# Altium schematic sheet DDR3_Memory.SchDoc: RNG RPI Interface
size 420 x 297 mm; Author: G.Kasprowicz; CompanyName: WUT ISE; DrawnBy: G.Kasprowicz; Organization: WUT ISE; Address1: PW ISE; Address2: Nowowiejska 15/19 00-665 Warsaw; Address3: gkasprow@gmail.com; Revision: 2; SheetNumber: -; SheetTotal: -; ModifiedBy: -; CheckedDate: -; Title2: DDR3 memory; DivGrp: WUT ISE; Designer: G.Kasprowicz; ModifiedDate: -; ProjectName: Sensor Box
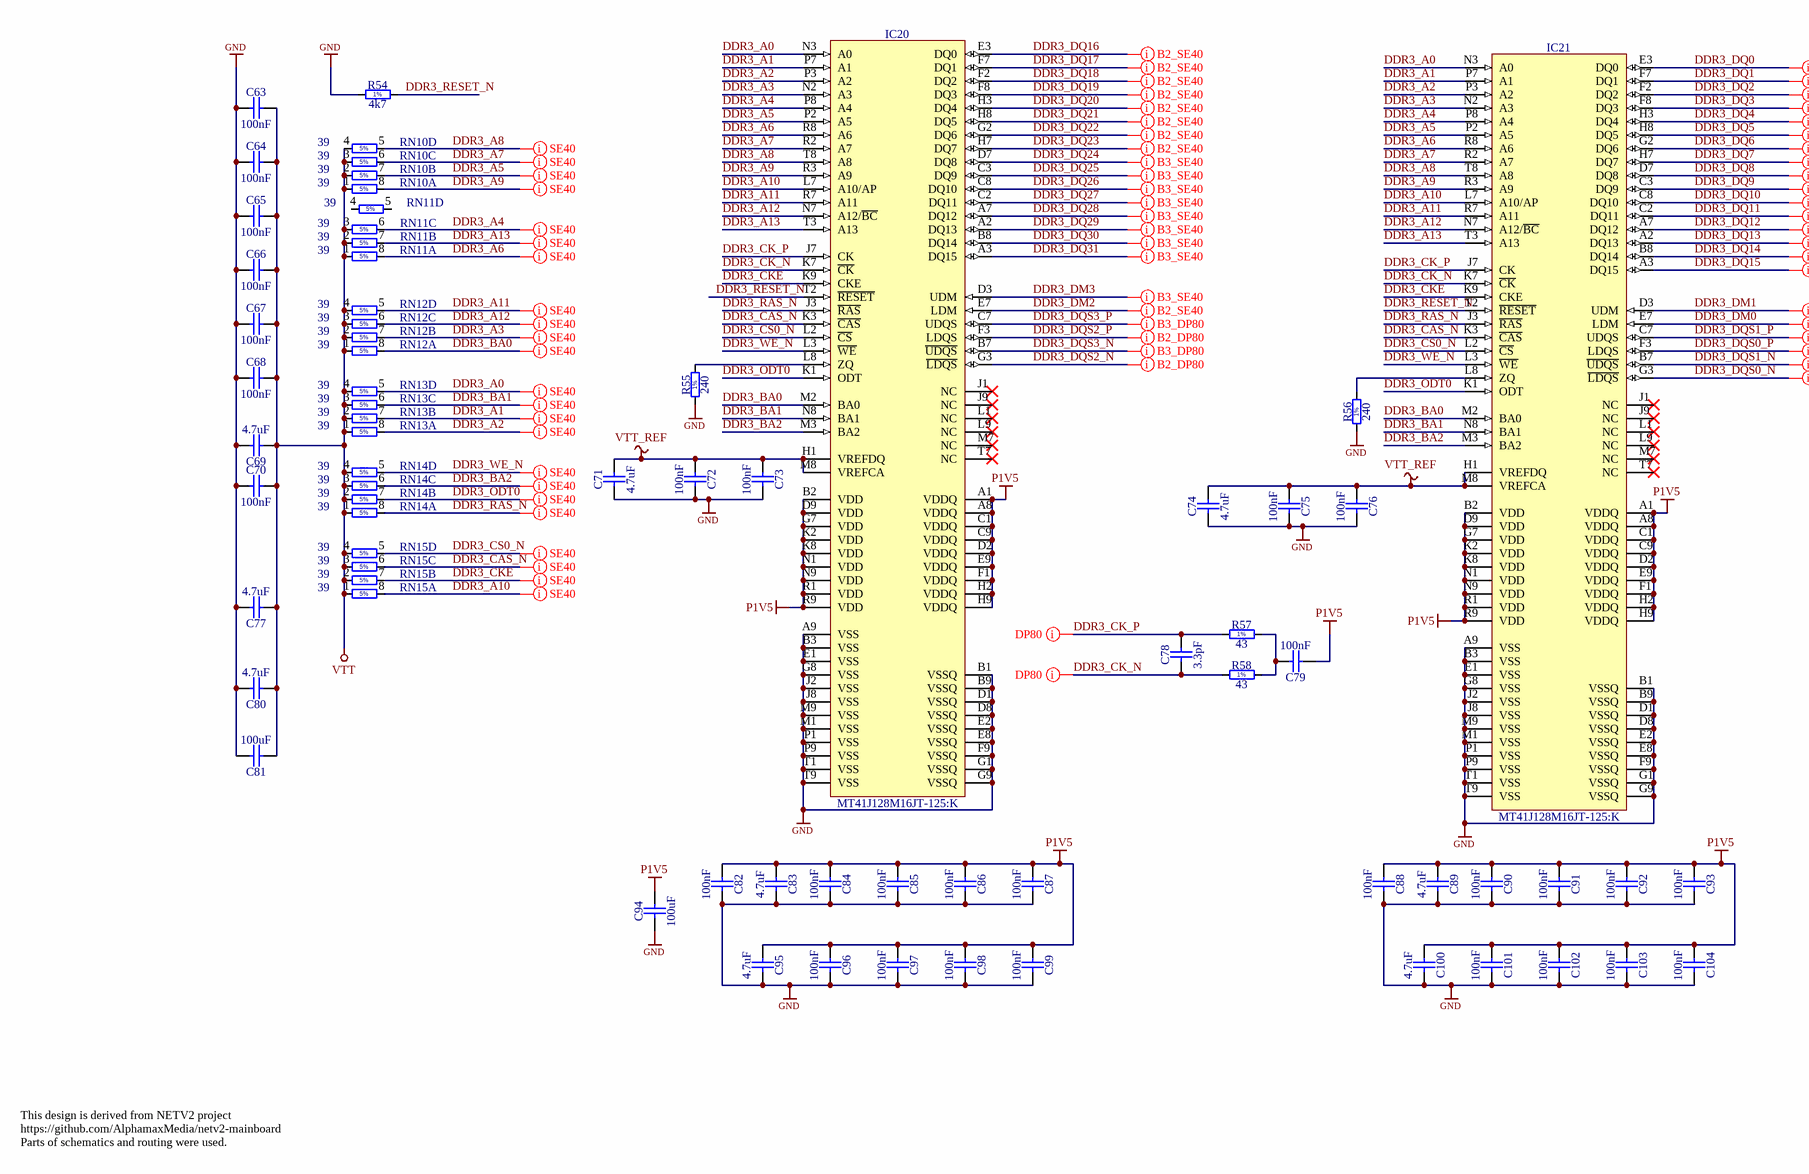
[diagram p0: DDR3_Memory.SchDoc]

## Parts
C63  100nF  [CAPC0603X33N]
C64  100nF  [CAPC0603X33N]
C65  100nF  [CAPC0603X33N]
C66  100nF  [CAPC0603X33N]
C67  100nF  [CAPC0603X33N]
C68  100nF  [CAPC0603X33N]
C69  4.7uF  [CAPC1005X55N]
C70  100nF  [CAPC0603X33N]
C71  4.7uF  [CAPC1005X55N]
C72  100nF  [CAPC0603X33N]
C73  100nF  [CAPC0603X33N]
C74  4.7uF  [CAPC1005X55N]
C75  100nF  [CAPC0603X33N]
C76  100nF  [CAPC0603X33N]
C77  4.7uF  [CAPC1005X55N]
C78  3.3pF  [CAPC1005X55N]
C79  100nF  [CAPC0603X33N]
C80  4.7uF  [CAPC1005X55N]
C81  100uF  [CAPC3216X180N]
C82  100nF  [CAPC0603X33N]
C83  4.7uF  [CAPC1005X55N]
C84  100nF  [CAPC0603X33N]
C85  100nF  [CAPC0603X33N]
C86  100nF  [CAPC0603X33N]
C87  100nF  [CAPC0603X33N]
C88  100nF  [CAPC0603X33N]
C89  4.7uF  [CAPC1005X55N]
C90  100nF  [CAPC0603X33N]
C91  100nF  [CAPC0603X33N]
C92  100nF  [CAPC0603X33N]
C93  100nF  [CAPC0603X33N]
C94  100uF  [CAPC3216X180N]
C95  4.7uF  [CAPC1005X55N]
C96  100nF  [CAPC0603X33N]
C97  100nF  [CAPC0603X33N]
C98  100nF  [CAPC0603X33N]
C99  100nF  [CAPC0603X33N]
C100  4.7uF  [CAPC1005X55N]
C101  100nF  [CAPC0603X33N]
C102  100nF  [CAPC0603X33N]
C103  100nF  [CAPC0603X33N]
C104  100nF  [CAPC0603X33N]
IC20  MT41J128M16JT-125:K  [BGA96C80P9X16_900X1400X120]
IC21  MT41J128M16JT-125:K  [BGA96C80P9X16_900X1400X120]
R54  4k7  [RESC1005X40N]
R55  240  [RESC1005X40N]
R56  240  [RESC1005X40N]
R57  43  [RESC1005X40N]
R58  43  [RESC1005X40N]
RN10  39  [RN_YAGEO_YC124]  (parts A,B,C,D of 4)
RN11  39  [RN_YAGEO_YC124]  (parts A,B,C,D of 4)
RN12  39  [RN_YAGEO_YC124]  (parts A,B,C,D of 4)
RN13  39  [RN_YAGEO_YC124]  (parts A,B,C,D of 4)
RN14  39  [RN_YAGEO_YC124]  (parts A,B,C,D of 4)
RN15  39  [RN_YAGEO_YC124]  (parts A,B,C,D of 4)

## Nets
GND: C63.1 C64.1 C65.1 C66.1 C67.1 C68.1 C69.2 C70.1 C71.1 C72.2 C73.2 C74.1 C75.2 C76.2 C77.2 C80.2 C81.2 C82.2 C83.2 C84.2 C85.2 C86.2 C87.2 C88.2 C89.2 C90.2 C91.2 C92.2 C93.2 C94.1 C95.2 C96.2 C97.2 C98.2 C99.2 C100.2 C101.2 C102.2 C103.2 C104.2 IC20.A9(VSS) IC20.B1(VSSQ) IC20.B3(VSS) IC20.B9(VSSQ) IC20.D1(VSSQ) IC20.D8(VSSQ) IC20.E1(VSS) IC20.E2(VSSQ) IC20.E8(VSSQ) IC20.F9(VSSQ) IC20.G1(VSSQ) IC20.G8(VSS) IC20.G9(VSSQ) IC20.J2(VSS) IC20.J8(VSS) IC20.M1(VSS) IC20.M9(VSS) IC20.P1(VSS) IC20.P9(VSS) IC20.T1(VSS) IC20.T9(VSS) IC21.A9(VSS) IC21.B1(VSSQ) IC21.B3(VSS) IC21.B9(VSSQ) IC21.D1(VSSQ) IC21.D8(VSSQ) IC21.E1(VSS) IC21.E2(VSSQ) IC21.E8(VSSQ) IC21.F9(VSSQ) IC21.G1(VSSQ) IC21.G8(VSS) IC21.G9(VSSQ) IC21.J2(VSS) IC21.J8(VSS) IC21.M1(VSS) IC21.M9(VSS) IC21.P1(VSS) IC21.P9(VSS) IC21.T1(VSS) IC21.T9(VSS) R54.1 R55.1 R56.1
P1V5: C79.1 C82.1 C83.1 C84.1 C85.1 C86.1 C87.1 C88.1 C89.1 C90.1 C91.1 C92.1 C93.1 C94.2 C95.1 C96.1 C97.1 C98.1 C99.1 C100.1 C101.1 C102.1 C103.1 C104.1 IC20.A1(VDDQ) IC20.A8(VDDQ) IC20.B2(VDD) IC20.C1(VDDQ) IC20.C9(VDDQ) IC20.D2(VDDQ) IC20.D9(VDD) IC20.E9(VDDQ) IC20.F1(VDDQ) IC20.G7(VDD) IC20.H2(VDDQ) IC20.H9(VDDQ) IC20.K2(VDD) IC20.K8(VDD) IC20.N1(VDD) IC20.N9(VDD) IC20.R1(VDD) IC20.R9(VDD) IC21.A1(VDDQ) IC21.A8(VDDQ) IC21.B2(VDD) IC21.C1(VDDQ) IC21.C9(VDDQ) IC21.D2(VDDQ) IC21.D9(VDD) IC21.E9(VDDQ) IC21.F1(VDDQ) IC21.G7(VDD) IC21.H2(VDDQ) IC21.H9(VDDQ) IC21.K2(VDD) IC21.K8(VDD) IC21.N1(VDD) IC21.N9(VDD) IC21.R1(VDD) IC21.R9(VDD)
VTT: C63.2 C64.2 C65.2 C66.2 C67.2 C68.2 C69.1 C70.2 C77.1 C80.1 C81.1 RN10.1 RN10.2 RN10.3 RN10.4 RN11.1 RN11.2 RN11.3 RN12.1 RN12.2 RN12.3 RN12.4 RN13.1 RN13.2 RN13.3 RN13.4 RN14.1 RN14.2 RN14.3 RN14.4 RN15.1 RN15.2 RN15.3 RN15.4
VTT_REF: C71.2 C72.1 C73.1 C74.2 C75.1 C76.1 IC20.H1(VREFDQ) IC20.M8(VREFCA) IC21.H1(VREFDQ) IC21.M8(VREFCA)
DDR3_A0: IC20.N3(A0) IC21.N3(A0) RN13.5
DDR3_A1: IC20.P7(A1) IC21.P7(A1) RN13.7
DDR3_A2: IC20.P3(A2) IC21.P3(A2) RN13.8
DDR3_A3: IC20.N2(A3) IC21.N2(A3) RN12.7
DDR3_A4: IC20.P8(A4) IC21.P8(A4) RN11.6
DDR3_A5: IC20.P2(A5) IC21.P2(A5) RN10.7
DDR3_A6: IC20.R8(A6) IC21.R8(A6) RN11.8
DDR3_A7: IC20.R2(A7) IC21.R2(A7) RN10.6
DDR3_A8: IC20.T8(A8) IC21.T8(A8) RN10.5
DDR3_A9: IC20.R3(A9) IC21.R3(A9) RN10.8
DDR3_A10: IC20.L7(A10/AP) IC21.L7(A10/AP) RN15.8
DDR3_A11: IC20.R7(A11) IC21.R7(A11) RN12.5
DDR3_A12: IC20.N7(A12/~{BC}) IC21.N7(A12/~{BC}) RN12.6
DDR3_A13: IC20.T3(A13) IC21.T3(A13) RN11.7
DDR3_BA0: IC20.M2(BA0) IC21.M2(BA0) RN12.8
DDR3_BA1: IC20.N8(BA1) IC21.N8(BA1) RN13.6
DDR3_BA2: IC20.M3(BA2) IC21.M3(BA2) RN14.6
DDR3_CAS_N: IC20.K3(~{CAS}) IC21.K3(~{CAS}) RN15.6
DDR3_CK_N: C78.1 IC20.K7(~{CK}) IC21.K7(~{CK}) R58.1
DDR3_CK_P: C78.2 IC20.J7(CK) IC21.J7(CK) R57.1
DDR3_CKE: IC20.K9(CKE) IC21.K9(CKE) RN15.7
DDR3_CS0_N: IC20.L2(~{CS}) IC21.L2(~{CS}) RN15.5
DDR3_DM0: IC21.E7(LDM)
DDR3_DM1: IC21.D3(UDM)
DDR3_DM2: IC20.E7(LDM)
DDR3_DM3: IC20.D3(UDM)
DDR3_DQ0: IC21.E3(DQ0)
DDR3_DQ1: IC21.F7(DQ1)
DDR3_DQ2: IC21.F2(DQ2)
DDR3_DQ3: IC21.F8(DQ3)
DDR3_DQ4: IC21.H3(DQ4)
DDR3_DQ5: IC21.H8(DQ5)
DDR3_DQ6: IC21.G2(DQ6)
DDR3_DQ7: IC21.H7(DQ7)
DDR3_DQ8: IC21.D7(DQ8)
DDR3_DQ9: IC21.C3(DQ9)
DDR3_DQ10: IC21.C8(DQ10)
DDR3_DQ11: IC21.C2(DQ11)
DDR3_DQ12: IC21.A7(DQ12)
DDR3_DQ13: IC21.A2(DQ13)
DDR3_DQ14: IC21.B8(DQ14)
DDR3_DQ15: IC21.A3(DQ15)
DDR3_DQ16: IC20.E3(DQ0)
DDR3_DQ17: IC20.F7(DQ1)
DDR3_DQ18: IC20.F2(DQ2)
DDR3_DQ19: IC20.F8(DQ3)
DDR3_DQ20: IC20.H3(DQ4)
DDR3_DQ21: IC20.H8(DQ5)
DDR3_DQ22: IC20.G2(DQ6)
DDR3_DQ23: IC20.H7(DQ7)
DDR3_DQ24: IC20.D7(DQ8)
DDR3_DQ25: IC20.C3(DQ9)
DDR3_DQ26: IC20.C8(DQ10)
DDR3_DQ27: IC20.C2(DQ11)
DDR3_DQ28: IC20.A7(DQ12)
DDR3_DQ29: IC20.A2(DQ13)
DDR3_DQ30: IC20.B8(DQ14)
DDR3_DQ31: IC20.A3(DQ15)
DDR3_DQS0_N: IC21.G3(~{LDQS})
DDR3_DQS0_P: IC21.F3(LDQS)
DDR3_DQS1_N: IC21.B7(~{UDQS})
DDR3_DQS1_P: IC21.C7(UDQS)
DDR3_DQS2_N: IC20.G3(~{LDQS})
DDR3_DQS2_P: IC20.F3(LDQS)
DDR3_DQS3_N: IC20.B7(~{UDQS})
DDR3_DQS3_P: IC20.C7(UDQS)
DDR3_ODT0: IC20.K1(ODT) IC21.K1(ODT) RN14.7
DDR3_RAS_N: IC20.J3(~{RAS}) IC21.J3(~{RAS}) RN14.8
DDR3_RESET_N: IC20.T2(~{RESET}) IC21.T2(~{RESET}) R54.2
DDR3_WE_N: IC20.L3(~{WE}) IC21.L3(~{WE}) RN14.5
NetC79_2: C79.2 R57.2 R58.2
NetIC20_L8: IC20.L8(ZQ) R55.2
NetIC21_L8: IC21.L8(ZQ) R56.2

Not connected (* = marked no-connect by the designer): IC20 J1(NC)* J9(NC)* L1(NC)* L9(NC)* M7(NC)* T7(NC)*; IC21 J1(NC)* J9(NC)* L1(NC)* L9(NC)* M7(NC)* T7(NC)*; RN11 4 5

## Layout directives
net class DP80: DDR3_CK_N, DDR3_CK_P
net class B2_SE40: DDR3_DM2, DDR3_DQ16, DDR3_DQ17, DDR3_DQ18, DDR3_DQ19, DDR3_DQ20, DDR3_DQ21, DDR3_DQ22, DDR3_DQ23
net class B3_SE40: DDR3_DM3, DDR3_DQ24, DDR3_DQ25, DDR3_DQ26, DDR3_DQ27, DDR3_DQ28, DDR3_DQ29, DDR3_DQ30, DDR3_DQ31
net class B3_DP80: DDR3_DQS3_N, DDR3_DQS3_P
net class B2_DP80: DDR3_DQS2_N, DDR3_DQS2_P
net class B0_SE40: DDR3_DM0, DDR3_DQ0, DDR3_DQ1, DDR3_DQ2, DDR3_DQ3, DDR3_DQ4, DDR3_DQ5, DDR3_DQ6, DDR3_DQ7
net class B1_SE40: DDR3_DM1, DDR3_DQ8, DDR3_DQ9, DDR3_DQ10, DDR3_DQ11, DDR3_DQ12, DDR3_DQ13, DDR3_DQ14, DDR3_DQ15
net class B1_DP80: DDR3_DQS1_N, DDR3_DQS1_P
net class B0_DP80: DDR3_DQS0_N, DDR3_DQS0_P
net class SE40: DDR3_A0, DDR3_A1, DDR3_A2, DDR3_A3, DDR3_A4, DDR3_A5, DDR3_A6, DDR3_A7, DDR3_A8, DDR3_A9, DDR3_A10, DDR3_A11, DDR3_A12, DDR3_A13, DDR3_BA0, DDR3_BA1, DDR3_BA2, DDR3_CAS_N, DDR3_CKE, DDR3_CS0_N, DDR3_ODT0, DDR3_RAS_N, DDR3_WE_N

## Notes on the sheet
- This design is derived from NETV2 project
  https://github.com/AlphamaxMedia/netv2-mainboard
  Parts of schematics and routing were used.
- Project/Equipment
- Document
- Designer
- Drawn by
- Check.by
- Copyright WUT ISE 2019.
  This documentation describes Open Hardware and is licensed under the CERN OHL v.1.1. You may redistribute and modify this documentation under the terms of the CERN OHL v.1.1. (http://ohwr.org/CERNOHL). This documentation is distributed WITHOUT ANY EXPRESS OR IMPLIED WARRANTY, INCLUDING OF MERCHANTABILITY, SATISFACTORY QUALITY AND FITNESS FOR A PARTICULAR PURPOSE. Please see the CERN OHL v.1.1 for applicable conditions.
- Contact
- File
- Last Mod.
- Print Date
- Sheet
- Size
- A3
- of
- Rev
- (in symbol R0402_4K7_1%_0.0625W_100PPM) 1%
- (in symbol R0402_43R_1%_0.0625W_100PPM) 1%
- (in symbol R0402_240R_1%_0.0625W_100PPM) 1%
- (in symbol RES_RN_39R_YAGEO_TC124-JR-0739RL, part A) 5%
- (in symbol RES_RN_39R_YAGEO_TC124-JR-0739RL, part B) 5%
- (in symbol RES_RN_39R_YAGEO_TC124-JR-0739RL, part C) 5%
- (in symbol RES_RN_39R_YAGEO_TC124-JR-0739RL, part D) 5%

## Library data of the parts
C63-C68 C70 C72 C73 C75 C76 C79 C82 C84-C88 C90-C93 C96-C99 C101-C104 = CC0201_100NF_6.3V_10%_X5R: Non-polarised capacitor; Part Description: SMD Multilayer Chip Ceramic Capacitor; Manufacturer: GENERIC; Manufacturer1 Part Number: 02016D104KAT2A; Voltage: 6.3V; TC: X5R; Tolerance: ±10%; Part Number: CC0201_100NF_6.3V_10%_X5R; Component Kind: Standard; Component Type: Standard; Pin Count: 2; Value: 100nF; Status: Not Recommended; Manufacturer Part Number: CC0201_100NF_6.3V_10%_X5R; Case: 0201; Mounted: Yes; Socket: No; SMD: Yes; Sense: No; Manufacturer1 Example: AVX; Manufacturer1 ComponentHeight: 0.33mm; HelpURL: \\cern.ch\dfs\Applications\Altium\Datasheets\CC0201_X5R_AVX.pdf; Author: CERN DEM JLC; CreateDate: 03.12.2007; LatestRevisionDate: 03.12.2007
C69 C71 C74 C77 C80 C83 C89 C95 C100 = CC0402_4.7UF_6.3V_20%_X5R: Non-polarised capacitor; Part Description: SMD Multilayer Chip Ceramic Capacitor; Manufacturer: GENERIC; Manufacturer1 Part Number: C1005X5R0J475M050BC; Voltage: 6.3V; TC: X5R; Tolerance: ±20%; Part Number: CC0402_4.7UF_6.3V_20%_X5R; Component Kind: Standard; Component Type: Standard; Pin Count: 2; Value: 4.7uF; Status: Preferred; Manufacturer Part Number: CC0402_4.7UF_6.3V_20%_X5R; Case: 0402; Mounted: Yes; Socket: No; SMD: Yes; Sense: No; Manufacturer1 Example: TDK; Manufacturer1 ComponentHeight: 0.65mm; HelpURL: \\cern.ch\dfs\Applications\Altium\Datasheets\CC0402_X5R_TDK_C.pdf; Author: CERN DEM JLC; CreateDate: 03.03.2015; LatestRevisionDate: 03.03.2015
C78 = CC0402_3.3PF_50V_0.25PF_C0G: Non-polarised capacitor; Part Description: SMD Multilayer Chip Ceramic Capacitor; Manufacturer: GENERIC; Manufacturer1 Part Number: C0402C339C5GACTU; Voltage: 50V; TC: C0G/NP0; Tolerance: ±0.25pF; Part Number: CC0402_3.3PF_50V_0.25PF_C0G; Component Kind: Standard; Component Type: Standard; Pin Count: 2; Value: 3.3pF; Status: Preferred; Manufacturer Part Number: CC0402_3.3PF_50V_0.25PF_C0G; Case: 0402; Mounted: Yes; Socket: No; SMD: Yes; Sense: No; Manufacturer1 Example: KEMET; Manufacturer1 ComponentHeight: 0.55mm; HelpURL: \\cern.ch\dfs\Applications\Altium\Datasheets\CC0805_C0G_KEMET_(Commercial Grade).pdf; Author: CERN DEM JLC; CreateDate: 03.12.2007; LatestRevisionDate: 22.04.2015
C81 C94 = CC1206_100UF_6.3V_20%_X5R: Non-polarised capacitor; Part Description: SMD Multilayer Chip Ceramic Capacitor; Manufacturer: GENERIC; Manufacturer1 Part Number: C1206C107M9PACTU; Voltage: 6.3V; TC: X5R; Tolerance: ±10%; Part Number: CC1206_100UF_6.3V_20%_X5R; Component Kind: Standard; Component Type: Standard; Pin Count: 2; Value: 100uF; Status: None; Manufacturer Part Number: CC1206_100UF_6.3V_20%_X5R; Case: 1206; Mounted: Yes; Socket: No; SMD: Yes; Sense: No; Manufacturer1 Example: KEMET; Manufacturer1 ComponentHeight: 1.8mm; HelpURL: \\cern.ch\dfs\Applications\Altium\Datasheets\CC1206_X5R_KEMET.pdf; Author: CERN DEM JLC; CreateDate: 26.09.2012; LatestRevisionDate: 26.09.2012
IC20 IC21 = MT41J128M16HA-15E: 16 Meg x 16 x 8 Banks DDR3 SDRAM; Part Description: +1.5V, 2Gb (16 Meg x 16 x 8 Banks) DDR3 SDRAM; Manufacturer: MICRON TECHNOLOGY; PressFit: No; Bonding: No; Part Number: MT41J128M16JT-125:K; Component Kind: Standard; Component Type: Standard; Device: MT41J128M16JT-125:K; PackageDescription: BGA 0.8mm, Pitch, Square 96 Pin, 9 Columns x 16 Rows, Body 14mm X 9mm X 1.2mm H; Manufacturer Part Number: MT41J128M16JT-125:K; Pin Count: 96; Case: BGA96; Mounted: Yes; Socket: No; SMD: Yes; Sense: No; ComponentHeight: 1.2mm; HelpURL: \\cern.ch\dfs\Applications\Altium\Datasheets\MT41J128M16HA-15E.pdf; Author: CERN DEM JLC; CreateDate: 19.11.2009; LatestRevisionDate: 02.11.2011
R54 = R0402_4K7_1%_0.0625W_100PPM: Resistor - 1%; Part Description: General Purpose Thick Film Chip Resistor; Manufacturer: GENERIC; Manufacturer1 Part Number: 232270674702L; TC: ±100ppm/°C; PressFit: No; Part Number: R0402_4K7_1%_0.0625W_100PPM; Component Kind: Standard; Component Type: Standard; Pin Count: 2; Value: 4k7; Status: Not Recommended; Power: 0.0625W; Tolerance: ±1%; Manufacturer Part Number: R0402_4K7_1%_0.0625W_100PPM; Case: 0402; Mounted: Yes; Sense: No; Socket: No; SMD: Yes; Manufacturer1 Example: YAGEO PHYCOMP; Manufacturer1 ComponentHeight: 0.4mm; HelpURL: \\cern.ch\dfs\Applications\Altium\Datasheets\R0402_Phycomp_RC0402.pdf; Author: CERN DEM JLC; CreateDate: 03.12.2007; LatestRevisionDate: 17.10.2012
R55 R56 = R0402_240R_1%_0.0625W_100PPM: Resistor - 1%; Part Description: General Purpose Thick Film Chip Resistor; Manufacturer: GENERIC; Manufacturer1 Part Number: 232270672401L; TC: ±100ppm/°C; PressFit: No; Part Number: R0402_240R_1%_0.0625W_100PPM; Component Kind: Standard; Component Type: Standard; Pin Count: 2; Value: 240; Status: Not Recommended; Power: 0.0625W; Tolerance: ±1%; Manufacturer Part Number: R0402_240R_1%_0.0625W_100PPM; Case: 0402; Mounted: Yes; Sense: No; Socket: No; SMD: Yes; Manufacturer1 Example: YAGEO PHYCOMP; Manufacturer1 ComponentHeight: 0.4mm; HelpURL: \\cern.ch\dfs\Applications\Altium\Datasheets\R0402_Phycomp_RC0402.pdf; Author: CERN DEM JLC; CreateDate: 03.12.2007; LatestRevisionDate: 17.10.2012
R57 R58 = R0402_43R_1%_0.0625W_100PPM: Resistor - 1%; Part Description: General Purpose Thick Film Chip Resistor; Manufacturer: GENERIC; Manufacturer1 Part Number: 232270674309L; TC: ±100ppm/°C; PressFit: No; Part Number: R0402_43R_1%_0.0625W_100PPM; Component Kind: Standard; Component Type: Standard; Pin Count: 2; Value: 43; Status: Not Recommended; Power: 0.0625W; Tolerance: ±1%; Manufacturer Part Number: R0402_43R_1%_0.0625W_100PPM; Case: 0402; Mounted: Yes; Sense: No; Socket: No; SMD: Yes; Manufacturer1 Example: YAGEO PHYCOMP; Manufacturer1 ComponentHeight: 0.4mm; HelpURL: \\cern.ch\dfs\Applications\Altium\Datasheets\R0402_Phycomp_RC0402.pdf; Author: CERN DEM JLC; CreateDate: 03.12.2007; LatestRevisionDate: 17.10.2012
RN10-RN15 = RES_RN_39R_YAGEO_TC124-JR-0739RL: 39R Resistor Network 4 Isolated Resistor 5%; Part Number: RN_10R_YAGEO_TC124-JR-0739RL; Part Description: Chip Resistor Array , 4 Isolated Resistors (Side Convex Type S Terminal), YC124 Series; Manufacturer: YAGEO; Power: 0.062W; TC: ±200ppm/°C; PressFit: No; Component Kind: Standard; Component Type: Standard; Pin Count: 8; Value: 39; Sense: No; Status: Recommended; Tolerance: ±5%; Manufacturer Part Number: TC124-JR-0739RL; Case: 0804; Mounted: Yes; Socket: No; SMD: Yes; ComponentHeight: 0.55mm; HelpURL: \\cern.ch\dfs\Applications\Altium\Datasheets\RN_YAGEO_YC124.pdf; Author: GK; CreateDate: 30.11.2011; LatestRevisionDate: 03.05.2017